# Altium schematic sheet FPGA.SchDoc
size A2
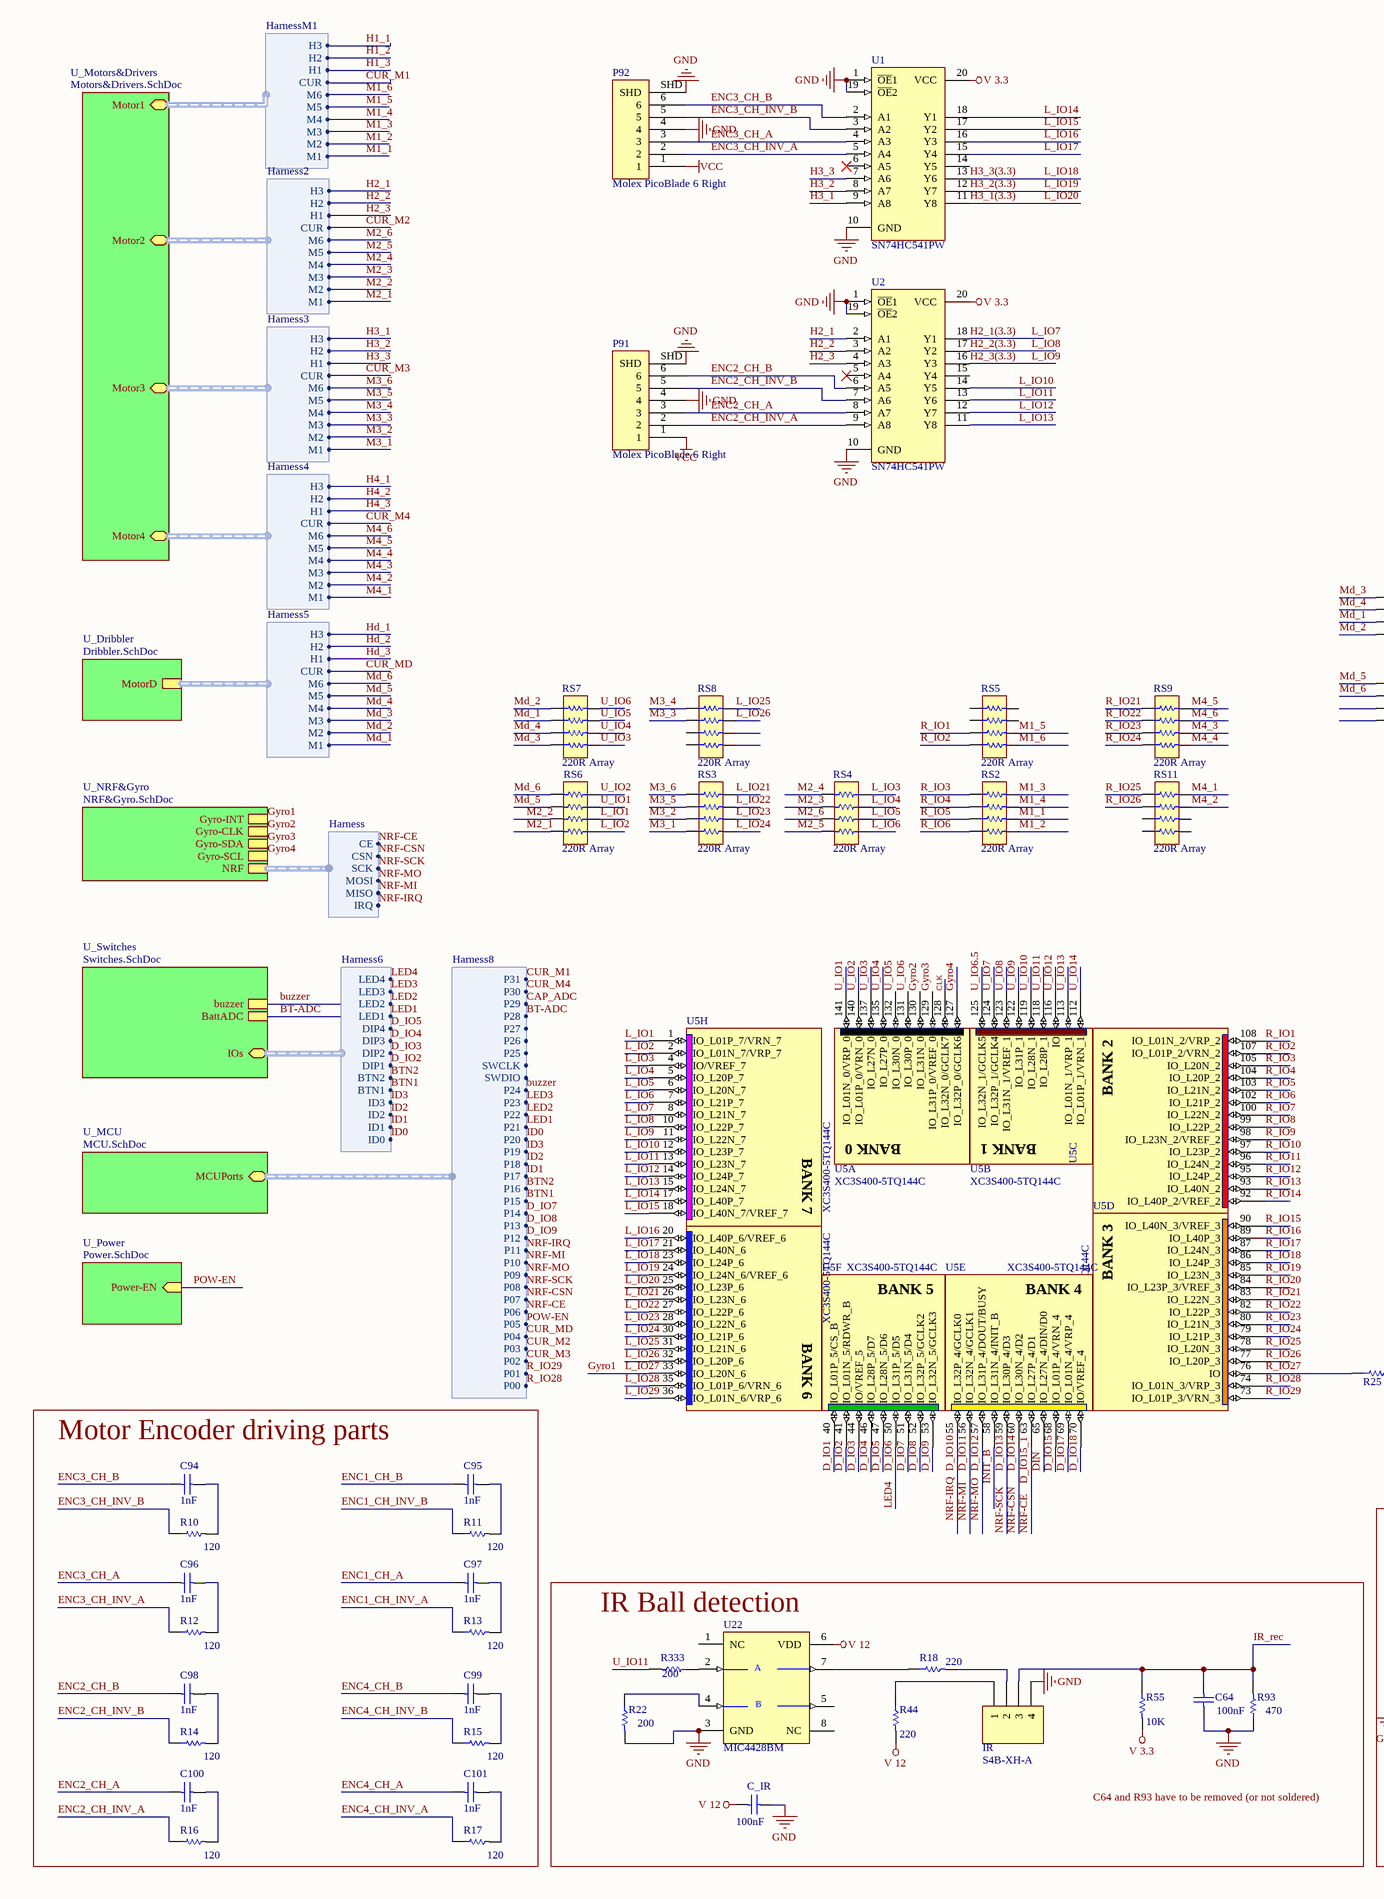
[diagram p0: FPGA.SchDoc, left]
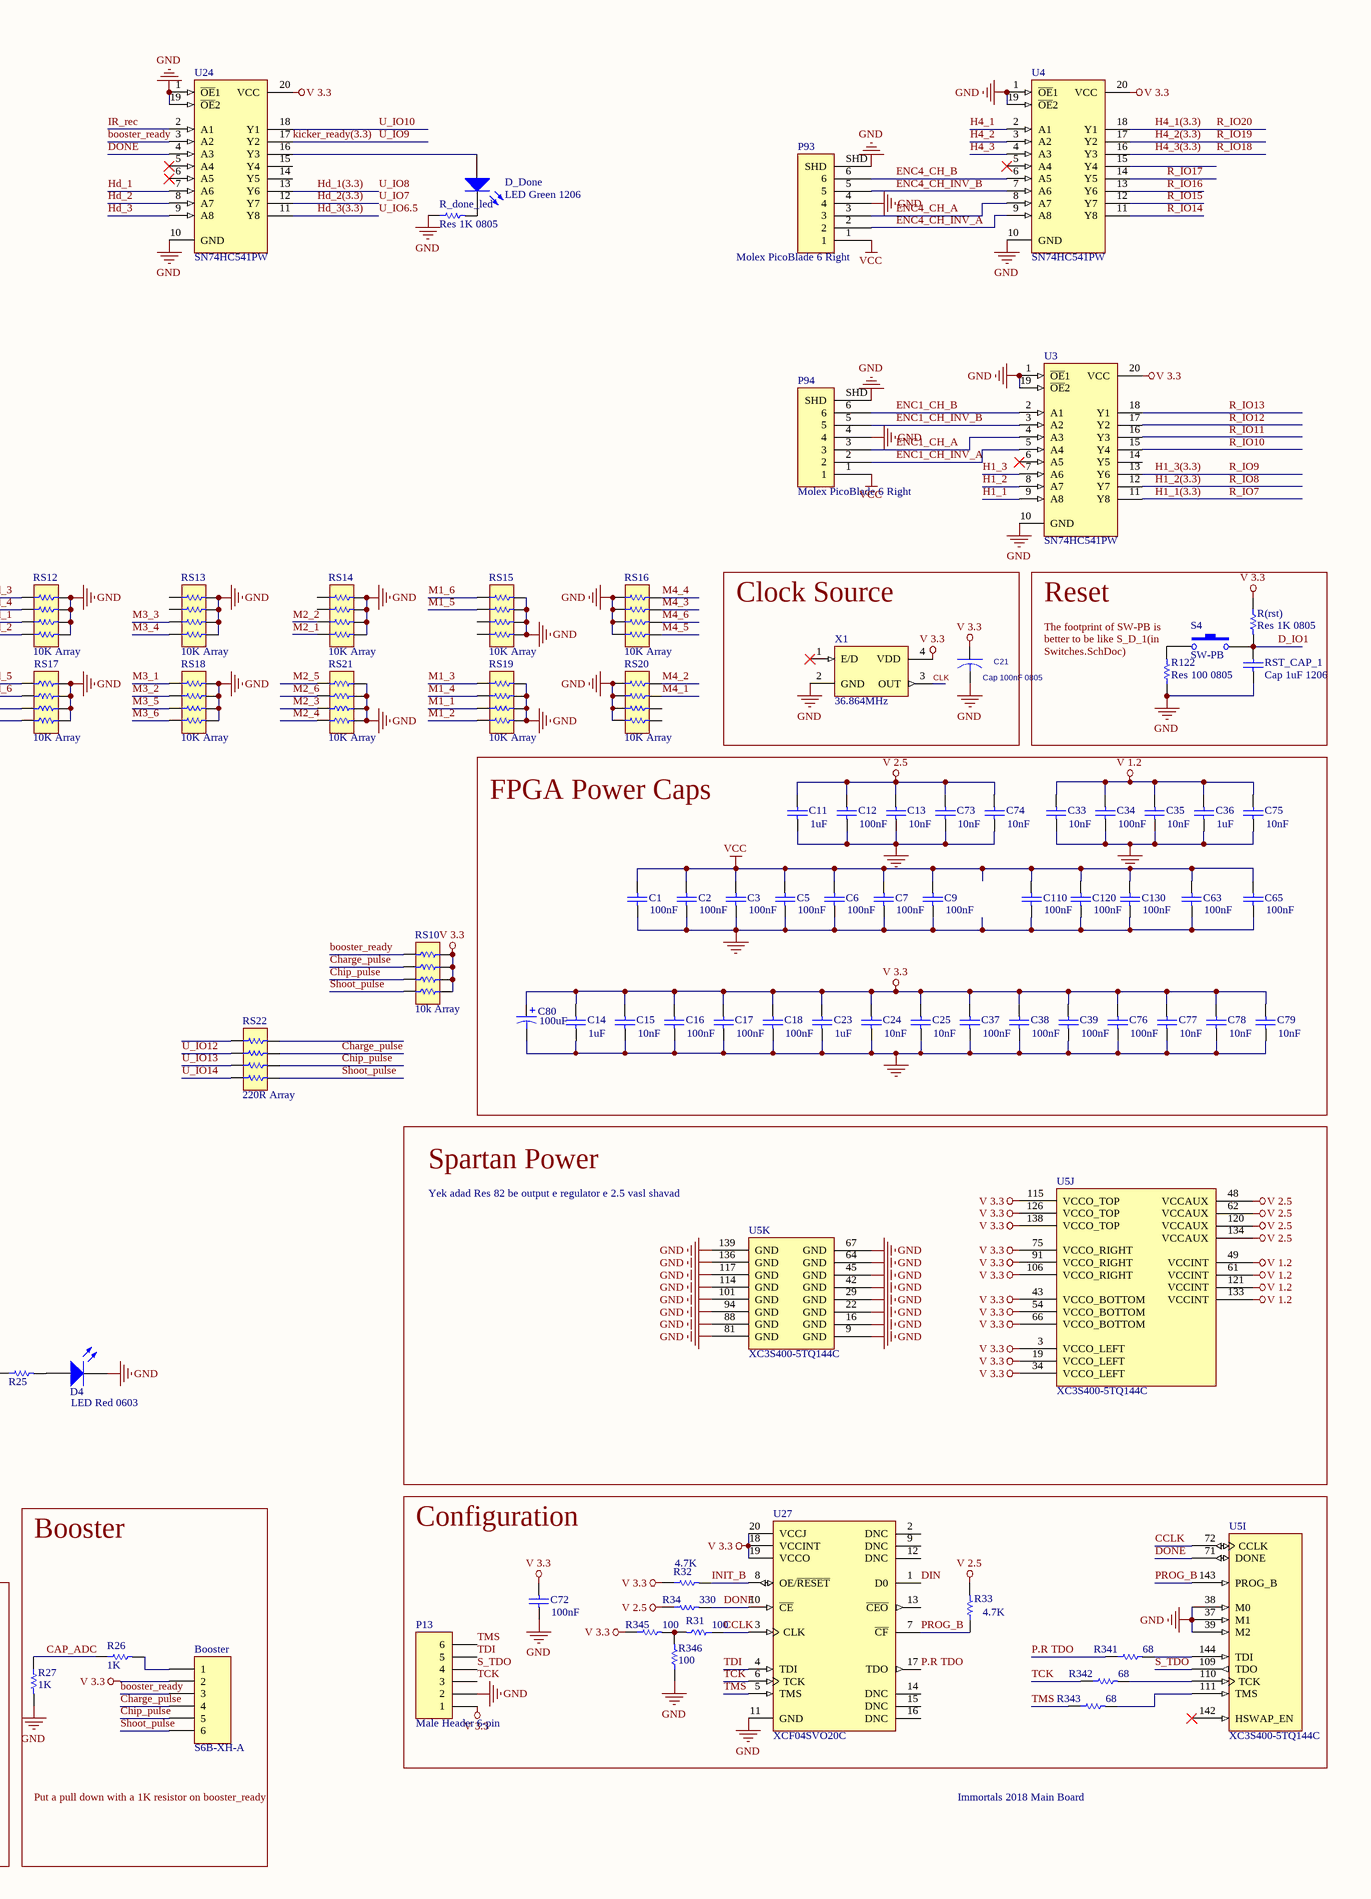
[diagram p1: FPGA.SchDoc, right]

## Parts
Booster  S6B-XH-A  [S6B-XH-A]
C1  value 100nF  [C1206]  (hidden comment: Cap 100nF 1206)
C2  value 100nF  [C1206]  (hidden comment: Cap 100nF 1206)
C3  value 100nF  [C1206]  (hidden comment: Cap 100nF 1206)
C5  value 100nF  [C1206]  (hidden comment: Cap 100nF 1206)
C6  value 100nF  [C1206]  (hidden comment: Cap 100nF 1206)
C7  value 100nF  [C1206]  (hidden comment: Cap 100nF 1206)
C9  value 100nF  [C1206]  (hidden comment: Cap 100nF 1206)
C11  value 1uF  [1608[0603]]  (hidden comment: Cap 1uF 0603)
C12  value 100nF  [1608[0603]]  (hidden comment: Cap 100nF 0603)
C13  value 10nF  [1608[0603]]  (hidden comment: Cap 10nF 0603)
C14  value 1uF  [1608[0603]]  (hidden comment: Cap 1uF 0603)
C15  value 10nF  [1608[0603]]  (hidden comment: Cap 10nF 0603)
C16  value 100nF  [1608[0603]]  (hidden comment: Cap 100nF 0603)
C17  value 100nF  [1608[0603]]  (hidden comment: Cap 100nF 0603)
C18  value 100nF  [1608[0603]]  (hidden comment: Cap 100nF 0603)
C21  Cap 100nF 0805  [2012[0805]]
C23  value 1uF  [1608[0603]]  (hidden comment: Cap 1uF 0603)
C24  value 10nF  [1608[0603]]  (hidden comment: Cap 10nF 0603)
C25  value 10nF  [1608[0603]]  (hidden comment: Cap 10nF 0603)
C33  value 10nF  [1608[0603]]  (hidden comment: Cap 10nF 0603)
C34  value 100nF  [1608[0603]]  (hidden comment: Cap 100nF 0603)
C35  value 10nF  [1608[0603]]  (hidden comment: Cap 10nF 0603)
C36  value 1uF  [1608[0603]]  (hidden comment: Cap 1uF 0603)
C37  value 100nF  [1608[0603]]  (hidden comment: Cap 100nF 0603)
C38  value 100nF  [1608[0603]]  (hidden comment: Cap 100nF 0603)
C39  value 100nF  [1608[0603]]  (hidden comment: Cap 100nF 0603)
C63  value 100nF  [C0805]  (hidden comment: Cap 100nF 0805)
C64  value 100nF  [1608[0603]]  (hidden comment: Cap 100nF 0603)
C65  value 100nF  [C0805]  (hidden comment: Cap 100nF 0805)
C72  value 100nF  [C0805]  (hidden comment: Cap 100nF 0805)
C73  value 10nF  [1608[0603]]  (hidden comment: Cap 10nF 0603)
C74  value 10nF  [1608[0603]]  (hidden comment: Cap 10nF 0603)
C75  value 10nF  [1608[0603]]  (hidden comment: Cap 10nF 0603)
C76  value 100nF  [1608[0603]]  (hidden comment: Cap 100nF 0603)
C77  value 10nF  [1608[0603]]  (hidden comment: Cap 10nF 0603)
C78  value 10nF  [1608[0603]]  (hidden comment: Cap 10nF 0603)
C79  value 10nF  [1608[0603]]  (hidden comment: Cap 10nF 0603)
C80  value 100uF  [6332[2512]]  (hidden comment: Cap 100uF 2512)
C94  value 1nF  [1608[0603]]  (hidden comment: Cap 1nF 0603)
C95  value 1nF  [1608[0603]]  (hidden comment: Cap 1nF 0603)
C96  value 1nF  [1608[0603]]  (hidden comment: Cap 1nF 0603)
C97  value 1nF  [1608[0603]]  (hidden comment: Cap 1nF 0603)
C98  value 1nF  [1608[0603]]  (hidden comment: Cap 1nF 0603)
C99  value 1nF  [1608[0603]]  (hidden comment: Cap 1nF 0603)
C100  value 1nF  [1608[0603]]  (hidden comment: Cap 1nF 0603)
C101  value 1nF  [1608[0603]]  (hidden comment: Cap 1nF 0603)
C110  value 100nF  [C1206]  (hidden comment: Cap 100nF 1206)
C120  value 100nF  [C1206]  (hidden comment: Cap 100nF 1206)
C130  value 100nF  [C1206]  (hidden comment: Cap 100nF 1206)
C_IR  value 100nF  [C0805]  (hidden comment: Cap 100nF 0805)
D4  LED Red 0603  [LED 0603]
D_Done  LED Green 1206  [3.2X1.6X1.1 - GREEN]
IR  S4B-XH-A  [S4B-XH-A]
P13  Male Header 6-pin  [HDR1X6]
P91  Molex PicoBlade 6 Right  [Molex PicoBlade 6 Right SMD]
P92  Molex PicoBlade 6 Right  [Molex PicoBlade 6 Right SMD]
P93  Molex PicoBlade 6 Right  [Molex PicoBlade 6 Right SMD]
P94  Molex PicoBlade 6 Right  [Molex PicoBlade 6 Right SMD]
R10  value 120  [1608[0603]]  (hidden comment: Res 120 0603)
R11  value 120  [1608[0603]]  (hidden comment: Res 120 0603)
R12  value 120  [1608[0603]]  (hidden comment: Res 120 0603)
R13  value 120  [1608[0603]]  (hidden comment: Res 120 0603)
R14  value 120  [1608[0603]]  (hidden comment: Res 120 0603)
R15  value 120  [1608[0603]]  (hidden comment: Res 120 0603)
R16  value 120  [1608[0603]]  (hidden comment: Res 120 0603)
R17  value 120  [1608[0603]]  (hidden comment: Res 120 0603)
R18  value 220  [2012[0805]]  (hidden comment: Res 220 0805)
R22  value 200  [2012[0805]]  (hidden comment: Res 200 0805)
R25  Res 330 0603  [R0603]  (value not drawn)
R26  value 1K  [2012[0805]]  (hidden comment: Res 1K 0805)
R27  value 1K  [2012[0805]]  (hidden comment: Res 1K 0805)
R31  value 100  [2012[0805]]  (hidden comment: Res 100 0805)
R32  value 4.7K  [2012[0805]]  (hidden comment: Res 4.7K 0805)
R33  value 4.7K  [2012[0805]]  (hidden comment: Res 4.7K 0805)
R34  value 330  [2012[0805]]  (hidden comment: Res 330 0805)
R44  value 220  [2012[0805]]  (hidden comment: Res 220 0805)
R55  value 10K  [2012[0805]]  (hidden comment: Res 10K 0805)
R93  value 470  [1608[0603]]  (hidden comment: Res 470 0603)
R122  Res 100 0805  [2012[0805]]
R333  value 200  [2012[0805]]  (hidden comment: Res 200 0805)
R341  value 68  [2012[0805]]  (hidden comment: Res 68 0805)
R342  value 68  [2012[0805]]  (hidden comment: Res 68 0805)
R343  value 68  [2012[0805]]  (hidden comment: Res 68 0805)
R345  value 100  [2012[0805]]  (hidden comment: Res 100 0805)
R346  value 100  [2012[0805]]  (hidden comment: Res 100 0805)
R(rst)  Res 1K 0805  [2012[0805]]
R_done_led  Res 1K 0805  [2012[0805]]
RS2  220R Array  [RES-4B]
RS3  220R Array  [RES-4B]
RS4  220R Array  [RES-4B]
RS5  220R Array  [RES-4B]
RS6  220R Array  [RES-4B]
RS7  220R Array  [RES-4B]
RS8  220R Array  [RES-4B]
RS9  220R Array  [RES-4B]
RS10  10k Array  [RES-4B]
RS11  220R Array  [RES-4B]
RS12  10K Array  [RES-4B]
RS13  10K Array  [RES-4B]
RS14  10K Array  [RES-4B]
RS15  10K Array  [RES-4B]
RS16  10K Array  [RES-4B]
RS17  10K Array  [RES-4B]
RS18  10K Array  [RES-4B]
RS19  10K Array  [RES-4B]
RS20  10K Array  [RES-4B]
RS21  10K Array  [RES-4B]
RS22  220R Array  [RES-4B]
RST_CAP_1  Cap 1uF 1206  [3216[1206]]
S4  SW-PB  [SPST-2]
U1  SN74HC541PW  [PW020_N]
U2  SN74HC541PW  [PW020_N]
U3  SN74HC541PW  [PW020_N]
U4  SN74HC541PW  [PW020_N]
U5  XC3S400-5TQ144C  [TQ144_L]  (parts A,B,C,D,E,F,G,H,I,J,K of 11)
U22  MIC4428BM  [NSO8_L]
U24  SN74HC541PW  [PW020_N]
U27  XCF04SVO20C  [VO20_N]
X1  36.864MHz  [QSMO_4200]

## Blocks framed on the sheet
Clock Source: C21 X1
Reset: R122 R(rst) RST_CAP_1 S4
FPGA Power Caps: C1-C3 C5-C7 C9 C11-C18 C23-C25 C33-C39 C63 C65 C73-C80 C110 C120 C130
Spartan Power: U5
Motor Encoder driving parts: C94-C101 R10-R17
Booster: Booster R26 R27
Configuration: C72 P13 R31-R34 R341-R343 R345 R346 U5 U27
IR Ball detection: C64 C_IR IR R18 R22 R44 R55 R93 R333 U22

## Sub-sheets
U_Dribbler = Dribbler.SchDoc: MotorD (harness Harness5)
U_MCU = MCU.SchDoc: MCUPorts (harness Harness8)
U_Motors&Drivers = Motors&Drivers.SchDoc: Motor1 (harness HarnessM1), Motor2 (harness Harness2), Motor4 (harness Harness4), Motor3 (harness Harness3)
U_NRF&Gyro = NRF&Gyro.SchDoc: NRF (harness Harness), Gyro-SCL, Gyro-SDA, Gyro-CLK, Gyro-INT
U_Power = Power.SchDoc: Power-EN (in)
U_Switches = Switches.SchDoc: BattADC, buzzer, IOs (harness Harness6)

## Harnesses
HarnessM1: M1, M2, M3, M4, M5, M6, CUR, H1, H2, H3
Harness2: M1, M2, M3, M4, M5, M6, CUR, H1, H2, H3
Harness3: M1, M2, M3, M4, M5, M6, CUR, H1, H2, H3
Harness4: M1, M2, M3, M4, M5, M6, CUR, H1, H2, H3
Harness5: M1, M2, M3, M4, M5, M6, CUR, H1, H2, H3
Harness6: ID0, ID1, ID2, ID3, BTN1, BTN2, DIP1, DIP2, DIP3, DIP4, LED1, LED2, LED3, LED4
Harness: IRQ, MISO, MOSI, SCK, CSN, CE
Harness8: P00, P01, P02, P03, P04, P05, P06, P07, P08, P09, P10, P11, P12, P13, P14, P15, P16, P17, P18, P19, P20, P21, P22, P23, P24, SWDIO, SWCLK, P25, P26, P27, P28, P29, P30, P31

## Nets
GND: C1.2 C2.2 C3.2 C5.2 C6.2 C7.2 C9.2 C11.1 C12.1 C13.1 C14.1 C15.1 C16.1 C17.1 C18.1 C21.2 C23.1 C24.1 C25.1 C33.1 C34.1 C35.1 C36.1 C37.1 C38.1 C39.1 C63.2 C64.1 C65.2 C72.2 C73.1 C74.1 C75.1 C76.1 C77.1 C78.1 C79.1 C80.2 C110.2 C120.2 C130.2 C_IR.2 D4.2(K) IR.4 P13.2 P91.4 P91.SHD P92.4 P92.SHD P93.4 P93.SHD P94.4 P94.SHD R22.2 R27.2 R93.1 R122.1 R346.1 R_done_led.1 RS12.2 RS12.4 RS12.6 RS12.8 RS13.2 RS13.4 RS13.6 RS13.8 RS14.2 RS14.4 RS14.6 RS14.8 RS15.2 RS15.4 RS15.6 RS15.8 RS16.1 RS16.3 RS16.5 RS16.7 RS17.1 RS17.3 RS17.5 RS17.7 RS18.2 RS18.4 RS18.6 RS18.8 RS19.2 RS19.4 RS19.6 RS19.8 RS20.1 RS20.3 RS20.5 RS20.7 RS21.1 RS21.3 RS21.5 RS21.7 RST_CAP_1.1 U1.1(~{OE}1) U1.10(GND) U1.19(~{OE}2) U2.1(~{OE}1) U2.10(GND) U2.19(~{OE}2) U3.1(~{OE}1) U3.10(GND) U3.19(~{OE}2) U4.1(~{OE}1) U4.10(GND) U4.19(~{OE}2) U5.9(GND) U5.16(GND) U5.22(GND) U5.29(GND) U5.37(M1) U5.38(M0) U5.39(M2) U5.42(GND) U5.45(GND) U5.64(GND) U5.67(GND) U5.81(GND) U5.88(GND) U5.94(GND) U5.101(GND) U5.114(GND) U5.117(GND) U5.136(GND) U5.139(GND) U22.3(GND) U24.1(~{OE}1) U24.10(GND) U24.19(~{OE}2) U27.11(GND) X1.2(GND)
V 1.2: C33.2 C34.2 C35.2 C36.2 C75.2 U5.49(VCCINT) U5.61(VCCINT) U5.121(VCCINT) U5.133(VCCINT)
V 2.5: C11.2 C12.2 C13.2 C73.2 C74.2 R33.2 R34.1 U5.48(VCCAUX) U5.62(VCCAUX) U5.120(VCCAUX) U5.134(VCCAUX)
V 3.3: Booster.2 C14.2 C15.2 C16.2 C17.2 C18.2 C21.1 C23.2 C24.2 C25.2 C37.2 C38.2 C39.2 C72.1 C76.2 C77.2 C78.2 C79.2 C80.1 P13.1 R32.1 R55.2 R345.1 R(rst).1 RS10.1 RS10.3 RS10.5 RS10.7 U1.20(VCC) U2.20(VCC) U3.20(VCC) U4.20(VCC) U5.3(VCCO_LEFT) U5.19(VCCO_LEFT) U5.34(VCCO_LEFT) U5.43(VCCO_BOTTOM) U5.54(VCCO_BOTTOM) U5.66(VCCO_BOTTOM) U5.75(VCCO_RIGHT) U5.91(VCCO_RIGHT) U5.106(VCCO_RIGHT) U5.115(VCCO_TOP) U5.126(VCCO_TOP) U5.138(VCCO_TOP) U24.20(VCC) U27.18(VCCINT) U27.19(VCCO) U27.20(VCCJ) X1.4(VDD)
V 12: C_IR.1 R44.2 U22.6(VDD)
VCC: C1.1 C2.1 C3.1 C5.1 C6.1 C7.1 C9.1 C63.1 C65.1 C110.1 C120.1 C130.1 P91.1 P92.1 P93.1 P94.1
booster_ready: Booster.3 RS10.8 U24.3(A2)
BT-ADC: sheet U_Switches/BattADC, sheet U_MCU/MCUPorts.P28
BTN1: sheet U_Switches/IOs.BTN1, sheet U_MCU/MCUPorts.P15
BTN2: sheet U_Switches/IOs.BTN2, sheet U_MCU/MCUPorts.P16
buzzer: sheet U_Switches/buzzer, sheet U_MCU/MCUPorts.P24
CAP_ADC: R26.1 R27.1 ; sheet U_MCU/MCUPorts.P29
CCLK: R31.1 U5.72(CCLK) U27.3(CLK)
Charge_pulse: Booster.4 RS10.6 RS22.4
Chip_pulse: Booster.5 RS10.4 RS22.6
CLK: U5.128(IO_L32N_0/GCLK7) X1.3(OUT)
CUR_M1: sheet U_Motors&Drivers/Motor1.CUR, sheet U_MCU/MCUPorts.P31
CUR_M2: sheet U_Motors&Drivers/Motor2.CUR, sheet U_MCU/MCUPorts.P03
CUR_M3: sheet U_Motors&Drivers/Motor3.CUR, sheet U_MCU/MCUPorts.P02
CUR_M4: sheet U_Motors&Drivers/Motor4.CUR, sheet U_MCU/MCUPorts.P30
CUR_MD: sheet U_Dribbler/MotorD.CUR, sheet U_MCU/MCUPorts.P04
D_IO1: R(rst).2 RST_CAP_1.2 S4.2 U5.40(IO_L01P_5/CS_B)
D_IO2: U5.41(IO_L01N_5/RDWR_B) ; sheet U_Switches/IOs.DIP1
D_IO3: U5.44(IO/VREF_5) ; sheet U_Switches/IOs.DIP2
D_IO4: U5.46(IO_L28P_5/D7) ; sheet U_Switches/IOs.DIP3
D_IO5: U5.47(IO_L28N_5/D6) ; sheet U_Switches/IOs.DIP4
D_IO6: U5.50(IO_L31P_5/D5) ; sheet U_Switches/IOs.LED4  [also labelled LED4]
D_IO7: U5.51(IO_L31N_5/D4) ; sheet U_MCU/MCUPorts.P14
D_IO8: U5.52(IO_L32P_5/GCLK2) ; sheet U_MCU/MCUPorts.P13
D_IO9: U5.53(IO_L32N_5/GCLK3) ; sheet U_MCU/MCUPorts.P12
D_IO10: U5.55(IO_L32P_4/GCLK0) ; sheet U_NRF&Gyro/NRF.IRQ, sheet U_MCU/MCUPorts.P11  [also labelled NRF-IRQ]
D_IO11: U5.56(IO_L32N_4/GCLK1) ; sheet U_NRF&Gyro/NRF.MISO, sheet U_MCU/MCUPorts.P10  [also labelled NRF-MI]
D_IO12: U5.57(IO_L31P_4/DOUT/BUSY) ; sheet U_NRF&Gyro/NRF.MOSI, sheet U_MCU/MCUPorts.P09  [also labelled NRF-MO]
D_IO13: U5.59(IO_L30P_4/D3) ; sheet U_NRF&Gyro/NRF.SCK, sheet U_MCU/MCUPorts.P08  [also labelled NRF-SCK]
D_IO14: U5.60(IO_L30N_4/D2) ; sheet U_NRF&Gyro/NRF.CSN, sheet U_MCU/MCUPorts.P07  [also labelled NRF-CSN]
D_IO15: U5.68(IO_L01P_4/VRN_4)
D_IO15_1: U5.63(IO_L27P_4/D1) ; sheet U_NRF&Gyro/NRF.CE, sheet U_MCU/MCUPorts.P06  [also labelled NRF-CE]
D_IO17: U5.69(IO_L01N_4/VRP_4)
D_IO18: U5.70(IO/VREF_4)
DIN: U5.65(IO_L27N_4/DIN/D0) U27.1(D0)
DONE: R34.2 U5.71(DONE) U24.4(A3) U27.10(~{CE})
ENC1_CH_A: C97.2 P94.3 U3.4(A3)
ENC1_CH_B: C95.2 P94.6 U3.2(A1)
ENC1_CH_INV_A: P94.2 R13.1 U3.5(A4)
ENC1_CH_INV_B: P94.5 R11.1 U3.3(A2)
ENC2_CH_A: C100.2 P91.3 U2.8(A7)
ENC2_CH_B: C98.2 P91.6 U2.6(A5)
ENC2_CH_INV_A: P91.2 R16.1 U2.9(A8)
ENC2_CH_INV_B: P91.5 R14.1 U2.7(A6)
ENC3_CH_A: C96.2 P92.3 U1.4(A3)
ENC3_CH_B: C94.2 P92.6 U1.2(A1)
ENC3_CH_INV_A: P92.2 R12.1 U1.5(A4)
ENC3_CH_INV_B: P92.5 R10.1 U1.3(A2)
ENC4_CH_A: C101.2 P93.3 U4.8(A7)
ENC4_CH_B: C99.2 P93.6 U4.6(A5)
ENC4_CH_INV_A: P93.2 R17.1 U4.9(A8)
ENC4_CH_INV_B: P93.5 R15.1 U4.7(A6)
Gyro1: U5.33(IO_L20N_6) ; sheet U_NRF&Gyro/Gyro-INT  [also labelled L_IO27]
Gyro2: U5.130(IO_L31N_0) ; sheet U_NRF&Gyro/Gyro-CLK
Gyro3: U5.129(IO_L31P_0/VREF_0) ; sheet U_NRF&Gyro/Gyro-SDA
Gyro4: U5.127(IO_L32P_0/GCLK6) ; sheet U_NRF&Gyro/Gyro-SCL
H1_1: U3.9(A8) ; sheet U_Motors&Drivers/Motor1.H3
H1_1(3.3): U3.11(Y8) U5.100(IO_L22N_2)  [also labelled R_IO7]
H1_2: U3.8(A7) ; sheet U_Motors&Drivers/Motor1.H2
H1_2(3.3): U3.12(Y7) U5.99(IO_L22P_2)  [also labelled R_IO8]
H1_3: U3.7(A6) ; sheet U_Motors&Drivers/Motor1.H1
H1_3(3.3): U3.13(Y6) U5.98(IO_L23N_2/VREF_2)  [also labelled R_IO9]
H2_1: U2.2(A1) ; sheet U_Motors&Drivers/Motor2.H3
H2_1(3.3): U2.18(Y1) U5.8(IO_L21N_7)  [also labelled L_IO7]
H2_2: U2.3(A2) ; sheet U_Motors&Drivers/Motor2.H2
H2_2(3.3): U2.17(Y2) U5.10(IO_L22P_7)  [also labelled L_IO8]
H2_3: U2.4(A3) ; sheet U_Motors&Drivers/Motor2.H1
H2_3(3.3): U2.16(Y3) U5.11(IO_L22N_7)  [also labelled L_IO9]
H3_1: U1.9(A8) ; sheet U_Motors&Drivers/Motor3.H3
H3_1(3.3): U1.11(Y8) U5.25(IO_L23P_6)  [also labelled L_IO20]
H3_2: U1.8(A7) ; sheet U_Motors&Drivers/Motor3.H2
H3_2(3.3): U1.12(Y7) U5.24(IO_L24N_6/VREF_6)  [also labelled L_IO19]
H3_3: U1.7(A6) ; sheet U_Motors&Drivers/Motor3.H1
H3_3(3.3): U1.13(Y6) U5.23(IO_L24P_6)  [also labelled L_IO18]
H4_1: U4.2(A1) ; sheet U_Motors&Drivers/Motor4.H3
H4_1(3.3): U4.18(Y1) U5.84(IO_L23P_3/VREF_3)  [also labelled R_IO20]
H4_2: U4.3(A2) ; sheet U_Motors&Drivers/Motor4.H2
H4_2(3.3): U4.17(Y2) U5.85(IO_L23N_3)  [also labelled R_IO19]
H4_3: U4.4(A3) ; sheet U_Motors&Drivers/Motor4.H1
H4_3(3.3): U4.16(Y3) U5.86(IO_L24P_3)  [also labelled R_IO18]
Hd_1: U24.7(A6) ; sheet U_Dribbler/MotorD.H3
Hd_1(3.3): U5.123(IO_L31N_1/VREF_1) U24.13(Y6)  [also labelled U_IO8]
Hd_2: U24.8(A7) ; sheet U_Dribbler/MotorD.H2
Hd_2(3.3): U5.124(IO_L32P_1/GCLK4) U24.12(Y7)  [also labelled U_IO7]
Hd_3: U24.9(A8) ; sheet U_Dribbler/MotorD.H1
Hd_3(3.3): U5.125(IO_L32N_1/GCLK5) U24.11(Y8)  [also labelled U_IO6.5]
ID0: sheet U_Switches/IOs.ID0, sheet U_MCU/MCUPorts.P20
ID1: sheet U_Switches/IOs.ID1, sheet U_MCU/MCUPorts.P17
ID2: sheet U_Switches/IOs.ID2, sheet U_MCU/MCUPorts.P18
ID3: sheet U_Switches/IOs.ID3, sheet U_MCU/MCUPorts.P19
INIT_B: R32.2 U5.58(IO_L31N_4/INIT_B) U27.8(OE/~{RESET})
IR_rec: C64.2 IR.3 R55.1 R93.2 U24.2(A1)
kicker_ready(3.3): U5.122(IO_L31P_1) U24.17(Y2)  [also labelled U_IO9]
L_IO1: RS6.3 U5.1(IO_L01P_7/VRN_7)
L_IO2: RS6.1 U5.2(IO_L01N_7/VRP_7)
L_IO3: RS4.7 U5.4(IO/VREF_7)
L_IO4: RS4.5 U5.5(IO_L20P_7)
L_IO5: RS4.3 U5.6(IO_L20N_7)
L_IO6: RS4.1 U5.7(IO_L21P_7)
L_IO10: U2.14(Y5) U5.12(IO_L23P_7)
L_IO11: U2.13(Y6) U5.13(IO_L23N_7)
L_IO12: U2.12(Y7) U5.14(IO_L24P_7)
L_IO13: U2.11(Y8) U5.15(IO_L24N_7)
L_IO14: U1.18(Y1) U5.17(IO_L40P_7)
L_IO15: U1.17(Y2) U5.18(IO_L40N_7/VREF_7)
L_IO16: U1.16(Y3) U5.20(IO_L40P_6/VREF_6)
L_IO17: U1.15(Y4) U5.21(IO_L40N_6)
L_IO21: RS3.2 U5.26(IO_L23N_6)
L_IO22: RS3.4 U5.27(IO_L22P_6)
L_IO23: RS3.6 U5.28(IO_L22N_6)
L_IO24: RS3.8 U5.30(IO_L21P_6)
L_IO25: RS8.2 U5.31(IO_L21N_6)
L_IO26: RS8.4 U5.32(IO_L20P_6)
L_IO28: U5.35(IO_L01P_6/VRN_6)
L_IO29: U5.36(IO_L01N_6/VRP_6)
LED1: sheet U_Switches/IOs.LED1, sheet U_MCU/MCUPorts.P21
LED2: sheet U_Switches/IOs.LED2, sheet U_MCU/MCUPorts.P22
LED3: sheet U_Switches/IOs.LED3, sheet U_MCU/MCUPorts.P23
M1_1: RS2.6 RS19.5 ; sheet U_Motors&Drivers/Motor1.M1
M1_2: RS2.8 RS19.7 ; sheet U_Motors&Drivers/Motor1.M2
M1_3: RS2.2 RS19.1 ; sheet U_Motors&Drivers/Motor1.M3
M1_4: RS2.4 RS19.3 ; sheet U_Motors&Drivers/Motor1.M4
M1_5: RS5.6 RS15.3 ; sheet U_Motors&Drivers/Motor1.M5
M1_6: RS5.8 RS15.1 ; sheet U_Motors&Drivers/Motor1.M6
M2_1: RS6.2 RS14.7 ; sheet U_Motors&Drivers/Motor2.M1
M2_2: RS6.4 RS14.5 ; sheet U_Motors&Drivers/Motor2.M2
M2_3: RS4.6 RS21.4 ; sheet U_Motors&Drivers/Motor2.M3
M2_4: RS4.8 RS21.2 ; sheet U_Motors&Drivers/Motor2.M4
M2_5: RS4.2 RS21.8 ; sheet U_Motors&Drivers/Motor2.M5
M2_6: RS4.4 RS21.6 ; sheet U_Motors&Drivers/Motor2.M6
M3_1: RS3.7 RS18.1 ; sheet U_Motors&Drivers/Motor3.M1
M3_2: RS3.5 RS18.3 ; sheet U_Motors&Drivers/Motor3.M2
M3_3: RS8.3 RS13.5 ; sheet U_Motors&Drivers/Motor3.M3
M3_4: RS8.1 RS13.7 ; sheet U_Motors&Drivers/Motor3.M4
M3_5: RS3.3 RS18.5 ; sheet U_Motors&Drivers/Motor3.M5
M3_6: RS3.1 RS18.7 ; sheet U_Motors&Drivers/Motor3.M6
M4_1: RS11.2 RS20.4 ; sheet U_Motors&Drivers/Motor4.M1
M4_2: RS11.4 RS20.2 ; sheet U_Motors&Drivers/Motor4.M2
M4_3: RS9.6 RS16.4 ; sheet U_Motors&Drivers/Motor4.M3
M4_4: RS9.8 RS16.2 ; sheet U_Motors&Drivers/Motor4.M4
M4_5: RS9.2 RS16.8 ; sheet U_Motors&Drivers/Motor4.M5
M4_6: RS9.4 RS16.6 ; sheet U_Motors&Drivers/Motor4.M6
Md_1: RS7.3 RS12.5 ; sheet U_Dribbler/MotorD.M1
Md_2: RS7.1 RS12.7 ; sheet U_Dribbler/MotorD.M2
Md_3: RS7.7 RS12.1 ; sheet U_Dribbler/MotorD.M3
Md_4: RS7.5 RS12.3 ; sheet U_Dribbler/MotorD.M4
Md_5: RS6.6 RS17.8 ; sheet U_Dribbler/MotorD.M5
Md_6: RS6.8 RS17.6 ; sheet U_Dribbler/MotorD.M6
P.R TDO: R341.1 U27.17(TDO)
POW-EN: sheet U_Power/Power-EN, sheet U_MCU/MCUPorts.P05
PROG_B: R33.1 U5.143(PROG_B) U27.7(~{CF})
R_IO1: RS5.5 U5.108(IO_L01N_2/VRP_2)
R_IO2: RS5.7 U5.107(IO_L01P_2/VRN_2)
R_IO3: RS2.1 U5.105(IO_L20N_2)
R_IO4: RS2.3 U5.104(IO_L20P_2)
R_IO5: RS2.5 U5.103(IO_L21N_2)
R_IO6: RS2.7 U5.102(IO_L21P_2)
R_IO10: U3.15(Y4) U5.97(IO_L23P_2)
R_IO11: U3.16(Y3) U5.96(IO_L24N_2)
R_IO12: U3.17(Y2) U5.95(IO_L24P_2)
R_IO13: U3.18(Y1) U5.93(IO_L40N_2)
R_IO14: U4.11(Y8) U5.92(IO_L40P_2/VREF_2)
R_IO15: U4.12(Y7) U5.90(IO_L40N_3/VREF_3)
R_IO16: U4.13(Y6) U5.89(IO_L40P_3)
R_IO17: U4.14(Y5) U5.87(IO_L24N_3)
R_IO21: RS9.1 U5.83(IO_L22N_3)
R_IO22: RS9.3 U5.82(IO_L22P_3)
R_IO23: RS9.5 U5.80(IO_L21N_3)
R_IO24: RS9.7 U5.79(IO_L21P_3)
R_IO25: RS11.1 U5.78(IO_L20N_3)
R_IO26: RS11.3 U5.77(IO_L20P_3)
R_IO27: R25.1 U5.76(IO)
R_IO28: U5.74(IO_L01N_3/VRP_3) ; sheet U_MCU/MCUPorts.P00
R_IO29: U5.73(IO_L01P_3/VRN_3) ; sheet U_MCU/MCUPorts.P01
S_TDO: P13.4 U5.109(TDO)
Shoot_pulse: Booster.6 RS10.2 RS22.8
TCK: P13.3 R342.1 U27.6(TCK)
TDI: P13.5 U27.4(TDI)
TMS: P13.6 R343.1 U27.5(TMS)
U_IO1: RS6.5 U5.141(IO_L01N_0/VRP_0)
U_IO2: RS6.7 U5.140(IO_L01P_0/VRN_0)
U_IO3: RS7.8 U5.137(IO_L27N_0)
U_IO4: RS7.6 U5.135(IO_L27P_0)
U_IO5: RS7.4 U5.132(IO_L30N_0)
U_IO6: RS7.2 U5.131(IO_L30P_0)
U_IO10: U5.119(IO_L28N_1) U24.18(Y1)
U_IO11: R333.2 U5.118(IO_L28P_1)
U_IO12: RS22.3 U5.116(IO)
U_IO13: RS22.5 U5.113(IO_L01N_1/VRP_1)
U_IO14: RS22.7 U5.112(IO_L01P_1/VRN_1)
NetBooster_1: Booster.1 R26.2
NetC94_1: C94.1 R10.2
NetC95_1: C95.1 R11.2
NetC96_1: C96.1 R12.2
NetC97_1: C97.1 R13.2
NetC98_1: C98.1 R14.2
NetC99_1: C99.1 R15.2
NetC100_1: C100.1 R16.2
NetC101_1: C101.1 R17.2
NetD4_1: D4.1(A) R25.2
NetD_Done_1: D_Done.1(A) U24.16(Y3)
NetD_Done_2: D_Done.2(K) R_done_led.2
NetIR_1: IR.1 R44.1
NetIR_2: IR.2 R18.2
NetR18_1: R18.1 U22.7(OUTA)
NetR22_1: R22.1 U22.4(INB)
NetR31_2: R31.2 R345.2 R346.2
NetR122_2: R122.2 S4.1
NetR333_1: R333.1 U22.2(INA)
NetR341_2: R341.2 U5.144(TDI)
NetR342_2: R342.2 U5.110(TCK)
NetR343_2: R343.2 U5.111(TMS)

Not connected (* = marked no-connect by the designer): RS5 1 2 3 4; RS8 5 6 7 8; RS11 5 6 7 8; RS13 1 3; RS14 1 3; RS15 5 7; RS17 2 4; RS20 6 8; RS22 1 2; U1 6(A5)* 14(Y5); U2 5(A4)* 15(Y4); U3 6(A5)* 14(Y5); U4 5(A4)* 15(Y4); U5 142(HSWAP_EN)*; U22 1(NC) 5(OUTB) 8(NC); U24 5(A4)* 6(A5)* 14(Y5) 15(Y4); U27 2(DNC) 9(DNC) 12(DNC) 13(~{CEO}) 14(DNC) 15(DNC) 16(DNC); X1 1(E/D)*

## Notes on the sheet
- The footprint of SW-PB is
- (near S4) better to be like S_D_1(in
- (near R122) Switches.SchDoc)
- Yek adad Res 82 be output e regulator e 2.5 vasl shavad
- C64 and R93 have to be removed (or not soldered)
- Put a pull down with a 1K resistor on booster_ready
- Immortals 2018 Main Board
- (in symbol MAX4427CSA) A; B
- (in symbol XC3S400-5TQ144C, part A) BANK 0
- (in symbol XC3S400-5TQ144C, part B) BANK 1
- (in symbol XC3S400-5TQ144C, part C) BANK 2
- (in symbol XC3S400-5TQ144C, part D) BANK 3
- (in symbol XC3S400-5TQ144C, part E) BANK 4
- (in symbol XC3S400-5TQ144C, part F) BANK 5
- (in symbol XC3S400-5TQ144C, part G) BANK 6
- (in symbol XC3S400-5TQ144C, part H) BANK 7

## Library data of the parts
Booster P13 = Header 6: Header, 6-Pin; LatestRevisionDate: 17-Jul-2002; LatestRevisionNote: Re-released for DXP Platform.; Publisher: Altium Limited
C1-C3 C5-C7 C9 C63 C65 C72 C110 C120 C130 C_IR = CAP: Capacitor; Fitted: True
C11-C18 C23-C25 C33-C39 C64 C73-C79 C94-C101 = Cap Semi: Capacitor (Semiconductor SIM Model); Published: 8-Jun-2000; LatestRevisionDate: 17-Jul-2002; LatestRevisionNote: Re-released for DXP Platform.; PackageReference: C1206; Publisher: Altium Limited
C21 = C_Dup1: Value: Cap 100nF 0805
C80 = Cap Pol3: Polarized Capacitor (Surface Mount); Published: 8-Jun-2000; LatestRevisionDate: 17-Jul-2002; LatestRevisionNote: Re-released for DXP Platform.; PackageReference: C0805; Publisher: Altium Limited
D4 = LED 0603: LED ,SMD ,0603; Published: 8-Jun-2000; LatestRevisionDate: 17-Jul-2002; LatestRevisionNote: Re-released for DXP Platform.; PackageVersion: Feb-2002; PackageReference: 3.2X1.6X1.1; Publisher: Altium Limited; Value: LED Red 0603
D_Done = LED2: Typical RED, GREEN, YELLOW, AMBER GaAs LED; Published: 8-Jun-2000; LatestRevisionDate: 17-Jul-2002; LatestRevisionNote: Re-released for DXP Platform.; PackageDocument: Feb-2002; PackageReference: 3.2X1.6X1.1; Publisher: Altium Limited; Value: LED Green 1206
IR = Header 4: Header, 4-Pin; LatestRevisionDate: 17-Jul-2002; LatestRevisionNote: Re-released for DXP Platform.; Publisher: Altium Limited; Value: S4B-XH-A
R10-R18 R22 R26 R27 R31-R34 R44 R55 R93 R333 R341-R343 R345 R346 R_done_led = Res Semi: Semiconductor Resistor; Published: 8-Jun-2000; LatestRevisionDate: 17-Jul-2002; LatestRevisionNote: Re-released for DXP Platform.; PackageReference: AXIAL-0.5; Publisher: Altium Limited
  R_done_led: Value: 1K
R25 = R0603: Res 0603; Part Field 1: 3144; Value: 330
R122 R(rst) = Res1: Resistor; Published: 8-Jun-2000; LatestRevisionDate: 17-Jul-2002; LatestRevisionNote: Re-released for DXP Platform.; PackageReference: AXIAL-0.3; Publisher: Altium Limited
  R122: Value: Res 100 0805
  R(rst): Value: Res 1K 0805
RS2-RS22 = Resister Array: Resistor Array ,SMD
RST_CAP_1 = Cap: Capacitor; Published: 8-Jun-2000; LatestRevisionDate: 17-Jul-2002; LatestRevisionNote: Re-released for DXP Platform.; PackageReference: RAD-0.3; Publisher: Altium Limited; Value: Cap 1uF 1206
S4 = SW-PB: Switch; Value: Mini push button; Published: 24-Mar-1999; LatestRevisionDate: 17-Jul-2002; LatestRevisionNote: Re-released for DXP Platform.; PackageReference: SPST-2; Publisher: Altium Limited
U1-U4 U24 = SN74HC541PW: Octal Buffer/Driver with 3-State Outputs; Published: 8-Jun-2000; LatestRevisionDate: 13-Apr-2006; LatestRevisionNote: IPC-7351 Footprint Added.; DatasheetVersion: May-1997; PackageVersion: Mar-2000; PackageReference: DW020; Publisher: Altium Limited; PackageDescription: 20-Pin Plastic Small Outline Integrated Circuit 1.27 mm Pitch; Code_JEDEC: MS-013; Code_IPC: SOIC127P1030-20; ComponentLink1Description: Manufacturer Link; ComponentLink1URL: http://www.ti.com/; ComponentLink2Description: Datasheet; ComponentLink2URL: http://www-s.ti.com/sc/ds/sn74hc541.pdf
U5 = XC3S400-5TQ144C: Spartan-3 1.2V FPGA, 97 User I/Os, 144-Pin TQFP, High Performance, Commercial Grade; Ordering Information: Additional code may have to be appended for different mask revision devices.; Published: 17-Sep-2003; LatestRevisionDate: 13-Apr-2006; LatestRevisionNote: IPC-7351 Footprint Added.; DatasheetVersion: ver2.3, Nov-2007; PackageVersion: ver1.2, Jun-2004; PackageReference: TQ144; Publisher: Altium Limited; PackageDescription: 144-Pin Thin Quad Flat Pack (TQ144); Code_JEDEC: MS-026-BFB; ComponentLink1Description: Manufacturer Link; ComponentLink1URL: http://www.xilinx.com/products/silicon_solutions/fpgas/spartan_series/spartan3_fpgas/index.htm; ComponentLink2Description: Datasheet; ComponentLink2URL: http://direct.xilinx.com/bvdocs/publications/ds099.pdf
U22 = MAX4427CSA: Dual High-Speed 1.5A MOSFET Driver; Published: 16-Jan-2001; LatestRevisionDate: 13-Apr-2006; LatestRevisionNote: IPC-7351 Footprint Added.; DatasheetVersion: Mar-1993; PackageReference: NSO8; Publisher: Altium Limited; PackageDescription: 8-Pin Small Outline Integrated Circuit 1.27 mm Pitch; Code_JEDEC: MS-012-AA; Code_IPC: SOIC127P600-8; ComponentLink1Description: Manufacturer Link; ComponentLink1URL: http://www.maxim-ic.com/; ComponentLink2Description: Datasheet; ComponentLink2URL: http://pdfserv.maxim-ic.com/en/ds/MAX4426-MAX4428.pdf
U27 = XCF04SVO20C: XCF00S Series, Platform Flash In-System Programmable Configuration 3.3V PROM, 20-Pin TSOP, 4-Megabit, Commercial Grade; Published: 17-Sep-2003; LatestRevisionDate: 04-Mar-2005; LatestRevisionNote: Stylized 3D Model Added.; DatasheetVersion: ver2.9, May-2006; PackageVersion: ver1.2.1, Apr-2005; PackageReference: VO20; Publisher: Altium Limited; PackageDescription: 20-Pin Thin Shrink Small Outline Package (VO20); Code_JEDEC: MO-153-AC; ComponentLink1Description: Manufacturer Link; ComponentLink1URL: http://www.xilinx.com/products/design_resources/config_sol/index.htm; ComponentLink2Description: Datasheet; ComponentLink2URL: http://direct.xilinx.com/bvdocs/publications/ds123.pdf
X1 = QSMO_4200: QSMO - 4200 SERIES, 40MHz, SURFACE MOUNT CRYSTAL OSCILLATOR; Published: 5-Jan-2004; DatasheetDocument: 15-Jul-02; Publisher: Altium Limited